# Altium schematic sheet ADL5611.SchDoc
size A4; Organization: Altium Limited; Address1: L3, 12a Rodborough Rd; Address2: Frenchs Forest; Address3: NSW; Address4: Australia 2086; DocumentNumber: 3; SheetNumber: 3; SheetTotal: 7
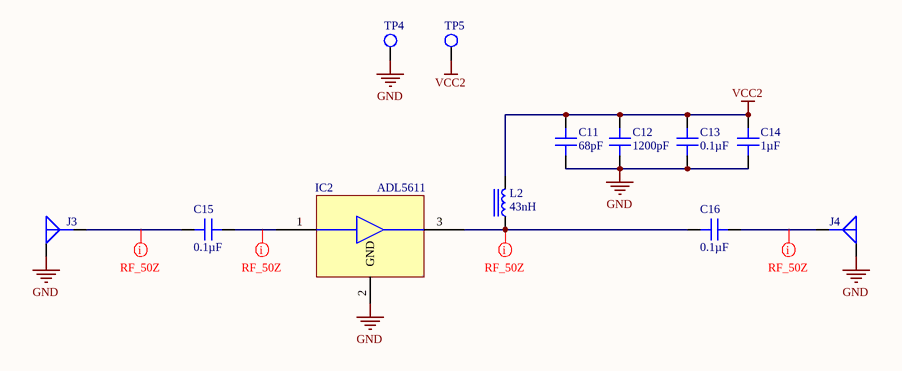
[diagram p0: ADL5611.SchDoc]

## Parts
C11  68pF  [CAP 0402_1005]
C12  1200pF  [CAP 0402_1005]
C13  0.1µF  [CAP 0402_1005]
C14  1µF  [CAP 0402_1005]
C15  0.1µF  [CAP 0402_1005]
C16  0.1µF  [CAP 0402_1005]
IC2  ADL5611  [Analog SOT-89]
J3  CON-SMA-EDGE-S  [CON-SMA-EDGE-S]  (value not drawn)
J4  CON-SMA-EDGE-S  [CON-SMA-EDGE-S]  (value not drawn)
L2  43nH  [0603HP]
TP4  Test Point-THM  [KEYSTONE-THM-TestPoint]  (value not drawn)
TP5  Test Point-THM  [KEYSTONE-THM-TestPoint]  (value not drawn)

## Nets
GND: C11.1 C12.1 C13.1 C14.1 IC2.2(GND) J3.2(G) J4.2(G) TP4.1(TP)
VCC2: C11.2 C12.2 C13.2 C14.2 L2.2 TP5.1(TP)
NetC15_1: C15.1 IC2.1(IN)
NetC15_2: C15.2 J3.1(S)
NetC16_1: C16.1 J4.1(S)
NetC16_2: C16.2 IC2.3(OUT) L2.1

## Layout directives
net class RF_50Z: NetC15_1, NetC15_2, NetC16_1, NetC16_2

## Notes on the sheet
- Title
- Author:
- Murat Kucukyilmaz
- Number:
- Date:
- Sheet
- of

## Library data of the parts
C11 = GCM1555C1H680JA16D: CAP CER 68PF 50V C0G/NP0 0402; Manufacturer: Murata Electronics; Temperature Coefficient: C0G, NP0; Tolerance: ±5%; Part Number: GCM1555C1H680JA16D; Value: 68pF; Applications: Automotive; Capacitance: 68pF; ComponentLink1Description: Datasheet; ComponentLink1URL: https://www.murata.com/~/media/webrenewal/support/library/catalog/products/capacitor/mlcc/c03e.ashx?la=en-us; ComponentLink2Description: DigiKey Link; ComponentLink2URL: http://digikey.com/product-detail/en/murata-electronics/GCM1555C1H680JA16D/490-12653-1-ND/5797622; Device Package: 0402 (1005 Metric); LastUpdated: 2.09.2020 01:02:15; Lifecycle Status: Active; Minimum Order: 1; Mounting Type: Surface Mount, MLCC; Operating Temperature: -55°C ~ 125°C; Package / Case: 0402 (1005 Metric); Packaging: TapeAndReel; PartId: 5827; Part Status: Active; Price: 0.01; Ratings: AEC-Q200; Series: GCM; Size / Dimension: 0.039" L x 0.020" W (1.00mm x 0.50mm); Supplier 1: DigiKey; Supplier Part Number 1: 490-12653-1-ND; Thickness (Max): 0.022" (0.55mm); Voltage - Rated: 50V
C12 = GCM155R71H122JA37D: CAP CER 1200PF 50V X7R 0402; Manufacturer: Murata Electronics; Tolerance: ±5%; Part Number: GCM155R71H122JA37D; Value: 1200pF; Applications: Automotive; Capacitance: 1200pF; ComponentLink1Description: Datasheet; ComponentLink1URL: https://search.murata.co.jp/Ceramy/image/img/A01X/G101/ENG/GCM155R71H122JA37-01.pdf; ComponentLink2Description: DigiKey Link; ComponentLink2URL: http://digikey.com/product-detail/en/murata-electronics/GCM155R71H122JA37D/490-17759-1-ND/8539995; Device Package: 0402 (1005 Metric); LastUpdated: 2.09.2020 01:02:22; Lifecycle Status: Active; Minimum Order: 1; Mounting Type: Surface Mount, MLCC; Operating Temperature: -55°C ~ 125°C; Package / Case: 0402 (1005 Metric); Packaging: TapeAndReel; PartId: 2713; Part Status: Active; Price: 0.01; Ratings: AEC-Q200; Series: GCM; Size / Dimension: 0.039" L x 0.020" W (1.00mm x 0.50mm); Supplier 1: DigiKey; Supplier Part Number 1: 490-17759-1-ND; Temperature Coefficient: X7R; Thickness (Max): 0.022" (0.55mm); Voltage - Rated: 50V
C13 C15 C16 = EMK105B7104KV-F: CAP CER 0.1UF 16V X7R 0402; Manufacturer: Taiyo Yuden; Tolerance: ±10%; Part Number: EMK105B7104KV-F; Value: 0.1µF; Applications: General Purpose; Capacitance: 0.1µF; ComponentLink1Description: Datasheet; ComponentLink1URL: https://ds.yuden.co.jp/TYCOMPAS/ut/detail?pn=EMK105B7104KV-F  &u=M; ComponentLink2Description: DigiKey Link; ComponentLink2URL: http://digikey.com/product-detail/en/taiyo-yuden/EMK105B7104KV-F/587-1451-1-ND/1004082; Device Package: 0402 (1005 Metric); LastUpdated: 2.09.2020 01:02:15; Lifecycle Status: Active; Minimum Order: 1; Mounting Type: Surface Mount, MLCC; Operating Temperature: -55°C ~ 125°C; Package / Case: 0402 (1005 Metric); Packaging: CutTape; PartId: 6070; Part Status: Active; Price: 0.10; Series: M; Size / Dimension: 0.039" L x 0.020" W (1.00mm x 0.50mm); Supplier 1: DigiKey; Supplier Part Number 1: 587-1451-1-ND; Temperature Coefficient: X7R; Thickness (Max): 0.022" (0.55mm); Voltage - Rated: 16V
C14 = CL05A105KP5NNNC: CAP CER 1UF 10V X5R 0402; Manufacturer: Samsung Electro-Mechanics; Tolerance: ±10%; Part Number: CL05A105KP5NNNC; Value: 1µF; Applications: General Purpose; Capacitance: 1µF; ComponentLink1Description: Datasheet; ComponentLink1URL: http://www.samsungsem.com/kr/support/product-search/mlcc/CL05A105KP5NNNC.jsp; ComponentLink2Description: DigiKey Link; ComponentLink2URL: http://digikey.com/product-detail/en/samsung-electro-mechanics/CL05A105KP5NNNC/1276-1076-1-ND/3889162; Device Package: 0402 (1005 Metric); LastUpdated: 2.09.2020 01:02:21; Lifecycle Status: Active; Minimum Order: 1; Mounting Type: Surface Mount, MLCC; Operating Temperature: -55°C ~ 85°C; Package / Case: 0402 (1005 Metric); Packaging: TapeAndReel; PartId: 3103; Part Status: Active; Price: 0.01; Series: CL; Size / Dimension: 0.039" L x 0.020" W (1.00mm x 0.50mm); Supplier 1: DigiKey; Supplier Part Number 1: 1276-1076-1-ND; Temperature Coefficient: X5R; Thickness (Max): 0.022" (0.55mm); Voltage - Rated: 10V
IC2 = ADL5611: IC AMP W-CDMA 30MHZ-6GHZ SOT89-3; Part Number: ADL5611; Supplier 1: Digi-Key; Supplier 2: Mouser; Supplier Part Number 1: ADL5611ARKZ-R7CT-ND; Supplier Part Number 2: 584-ADL5611ARKZ-R7
J3 J4 = CON-SMA-EDGE-S: CONN SMA JACK STR EDGE MNT; Part Number: CON-SMA-EDGE-S; Supplier 1: Digi-Key; Supplier 2: Mouser; Supplier Part Number 1: CON-SMA-EDGE-S-ND; Supplier Part Number 2: 223-CON-SMA-EDGE-S
L2 = 0603HP-43NXGLW: Fixed Inductors 0603 43nH Unshld 2% 810mA 170mOhms; Value: 43nH; Supplier 1: Mouser; Supplier Part Number 1: 994-0603HP-43NXGLW
TP4 TP5 = Test Point-THM: THRU HOLE MOUNT TEST POINTS; Supplier 1: Digi-Key; Supplier 2: Mouser; Supplier Part Number 1: 36-5012-ND; Supplier Part Number 2: 534-5012